# EAGLE design SLogger (EAGLE 6.3)
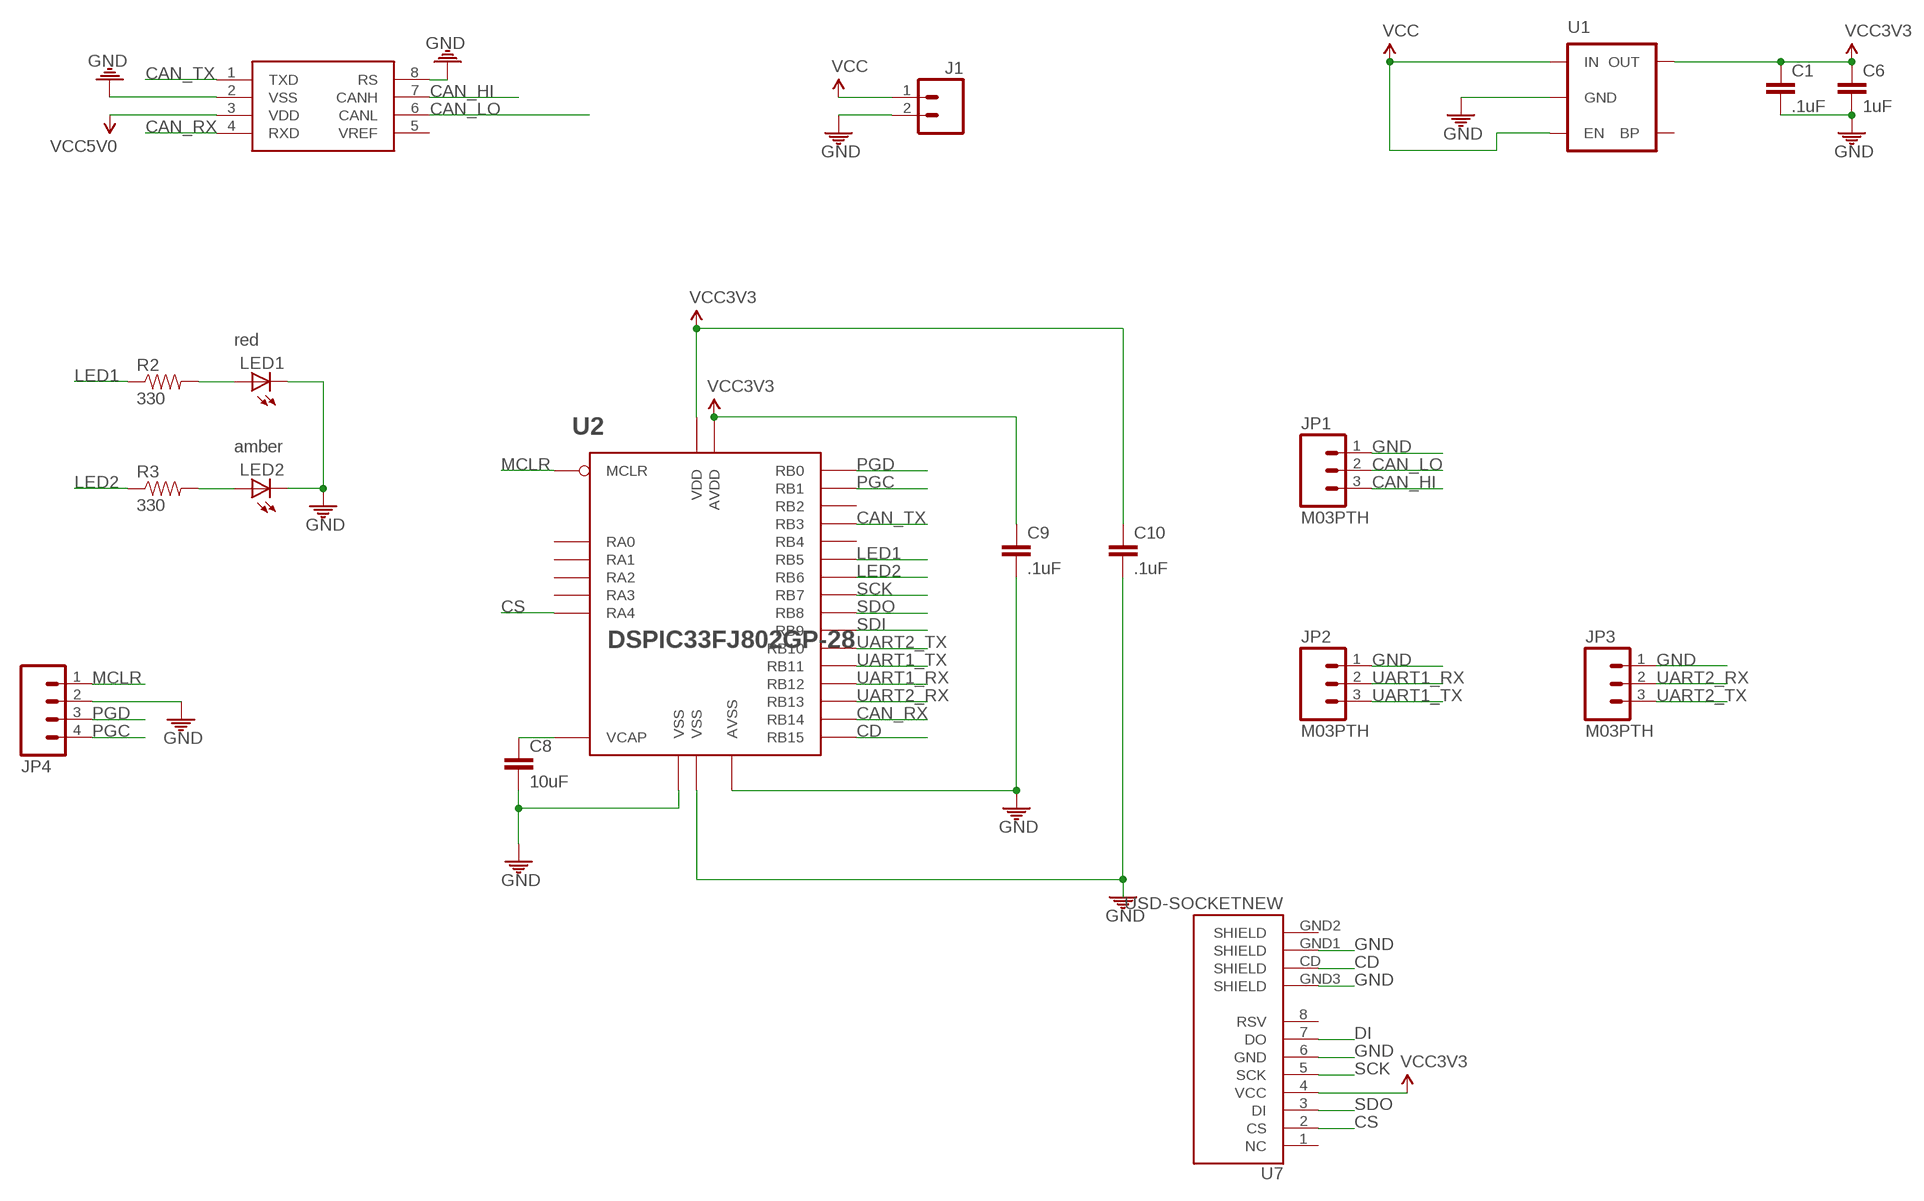
[diagram p0: schematic, sheet 1]

## Parts
C1  .1uF  CAP0805  [0805]
C6  1uF  CAP0805  [0805]
C8  10uF  CAP0805  [0805]
C9  .1uF  CAP0805  [0805]
C10  .1uF  CAP0805  [0805]
J1  M02PTH  [1X02]
JP1  M03PTH  [1X03]
JP2  M03PTH  [1X03]
JP3  M03PTH  [1X03]
JP4  M04PTH  [1X04]
LED1  LED0805  [LED-0805]
LED2  LED0805  [LED-0805]
R2  330  RESISTOR0805-RES  [0805]
R3  330  RESISTOR0805-RES  [0805]
U1  MIC52053.3V  [SOT23-5]
U2  DSPIC33FJ802GP-28  [SOIC28-W]
U4  MCP2551  [SO08]
U7  USD-SOCKETNEW  [MICRO-SD-SOCKET-PP]

## Nets
CAN_HI [small]: JP1.3 U4.7(CANH)
CAN_LO [small]: JP1.2 U4.6(CANL)
CAN_RX: U2.P$25(RB14) U4.4(RXD)
CAN_TX [small]: U2.P$7(RB3) U4.1(TXD)
CD: U2.P$26(RB15) U7.CD(SHIELD)
CS [small]: U2.P$12(RA4) U7.2(CS)
DI [small]: U7.7(DO)
GND [power]: C1.2 C6.2 C8.2 C9.2 C10.2 J1.2 JP1.1 JP2.1 JP3.1 JP4.2 LED1.2(C) LED2.2(C) U1.2(GND) U2.P$8(VSS) U2.P$19(VSS) U2.P$27(AVSS) U4.2(VSS) U4.8(RS) U7.6(GND) U7.GND1(SHIELD) U7.GND3(SHIELD)
LED1: R2.1 U2.P$14(RB5)
LED2: R3.1 U2.P$15(RB6)
MCLR [small]: JP4.1 U2.P$1(MCLR)
N$1 [small]: LED1.1(A) R2.2
N$3 [small]: LED2.1(A) R3.2
N$7: C8.1 U2.P$20(VCAP)
PGC [small]: JP4.4 U2.P$5(RB1)
PGD [small]: JP4.3 U2.P$4(RB0)
SCK [small]: U2.P$16(RB7) U7.5(SCK)
SDI [small]: U2.P$18(RB9)
SDO: U2.P$17(RB8) U7.3(DI)
UART1_RX [small]: JP2.2 U2.P$23(RB12)
UART1_TX [small]: JP2.3 U2.P$22(RB11)
UART2_RX [small]: JP3.2 U2.P$24(RB13)
UART2_TX [small]: JP3.3 U2.P$21(RB10)
VCC [power_in]: J1.1 U1.1(IN) U1.3(EN)
VCC3V3 [power]: C1.1 C6.1 C9.1 C10.1 U1.5(OUT) U2.P$13(VDD) U2.P$28(AVDD) U7.4(VCC)
VCC5V0 [power]: U4.3(VDD)
Unconnected: U1.4(BP) U2.P$2(RA0) U2.P$3(RA1) U2.P$6(RB2) U2.P$9(RA2) U2.P$10(RA3) U2.P$11(RB4) U4.5(VREF) U7.1(NC) U7.8(RSV) U7.GND2(SHIELD)

## Library data of the parts
C1 C6 C8-C10 = ASL:CAP: Capacitor Standard 0603 ceramic capacitor, and 0.1" leaded capacitor.
J1 = ASL:M02: Header 2 Standard 2-pin 0.1" header. Use with straight break away headers (SKU : PRT-00116), right angle break away headers (PRT-00553), swiss pins (PRT-00743), machine pins (PRT-00117), and female headers (PRT-00115). Molex polarized connector foot print use with SKU : PRT-08233 with associated crimp pins and housings.
JP1-JP3 = ASL:M03: Header 3 Standard 3-pin 0.1" header. Use with straight break away headers (SKU : PRT-00116), right angle break away headers (PRT-00553), swiss pins (PRT-00743), machine pins (PRT-00117), and female headers (PRT-00115). Molex polarized connector foot print use with SKU : PRT-08232 with associated crimp pins and housings.
JP4 = SparkFun-Connectors:M04: Header 4 Standard 4-pin 0.1" header. Use with straight break away headers (SKU : PRT-00116), right angle break away headers (PRT-00553), swiss pins (PRT-00743), machine pins (PRT-00117), and female headers (PRT-00115). Molex polarized connector foot print use with SKU : PRT-08231 with associated crimp pins and housings. 1MM SMD Version SKU: PRT-10208
LED1 = ASL:LED: LEDs Standard schematic elements and footprints for 5mm, 3mm, 1206, and 0603 sized LEDs. 5mm - Spark Fun Electronics SKU : COM-00529 (and others); COLOR: red
LED2 = ASL:LED: LEDs Standard schematic elements and footprints for 5mm, 3mm, 1206, and 0603 sized LEDs. 5mm - Spark Fun Electronics SKU : COM-00529 (and others); COLOR: amber
R2 R3 = CMPE118lib:RESISTOR: Resistor Basic schematic elements and footprints for 0603, 1206, and PTH resistors.
U1 = SparkFun-PowerIC:MIC5205: MIC5205 150mA vreg 3.3V - VREG-00822 5V - VREG-00823; PROD_ID: VREG-00822
U2 = CMPE118lib:DSPIC33FJ*802GP-28: dspic33fj*802gp 28pin
U4 = SparkFun:MCP2551
U7 = ASL:USD-SOCKET: microSD Socket Push-push type uSD socket. Schematic element and footprint production proven. Spark Fun Electronics SKU : PRT-00127. tDoc lines correctly indicate media card edge positions when inserting (unlocked, locked, depressed).

## Net classes
0 default: width 0.254 mm
1 power: width 0.406 mm, clearance 0.254 mm to class 0, clearance 0.508 mm
2 small: width 0.203 mm, clearance 0.254 mm to class 1
3 power_in: width 0.508 mm, clearance 0.762 mm to class 1, clearance 0.762 mm

## Board
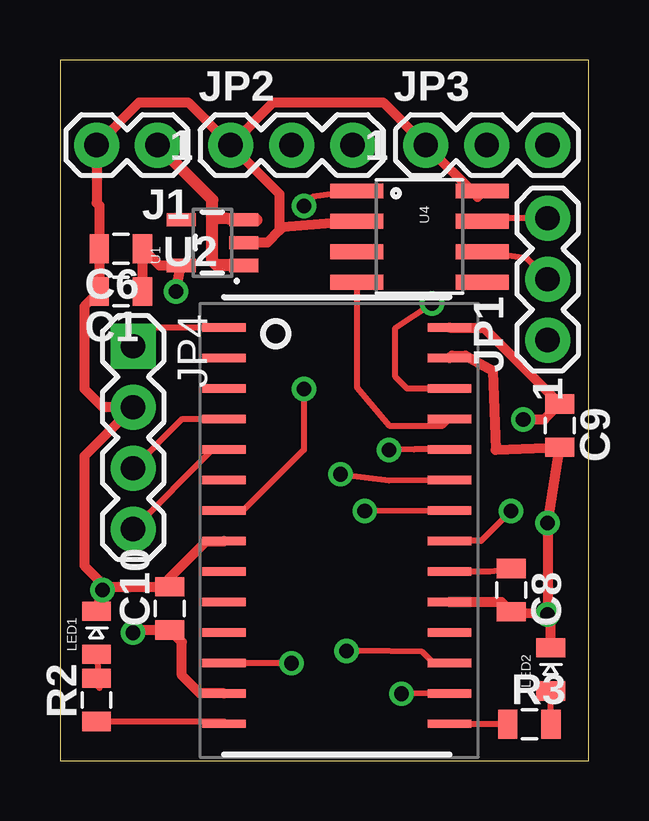
[diagram p1: board, top side]
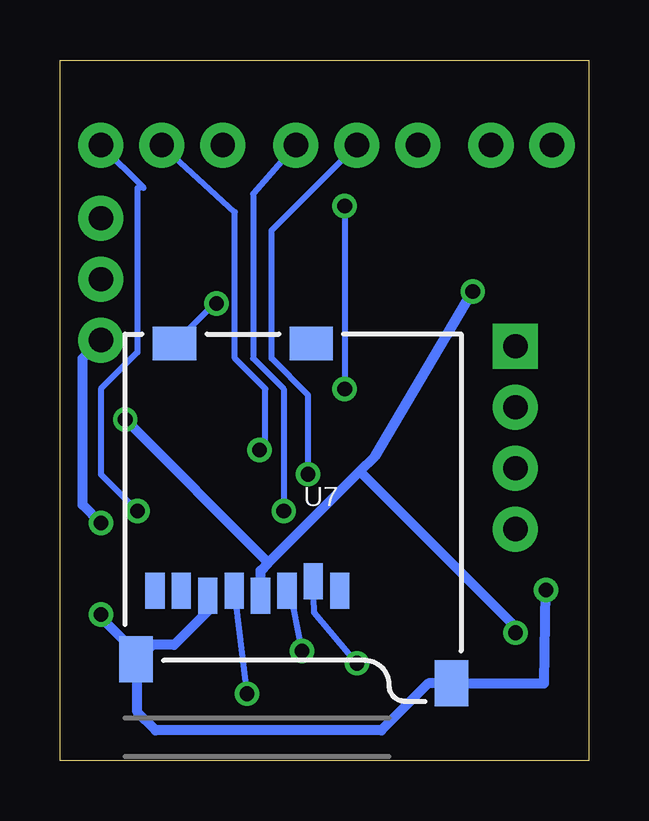
[diagram p2: board, bottom side, seen from below]

Size 22.02 x 29.2 mm. Coordinates in mm from the lower left corner, seen from the top.
Outline: 0,0 22.02,0 22.02,29.2 0,29.2 0,0
Copper layers (1*16): Top 0.035mm / dielectric 1.5mm / Bottom 0.035mm
Design rules "default": minimum track width 10mil, minimum drill 24mil, track to track 8mil, track to pad 8mil, pad to pad 8mil, via to via 8mil, smd to smd 8mil, copper to edge 40mil, drill to drill 8mil, minimum pad ring 10mil, minimum via ring 8mil, stop-mask expansion 4mil, vias tented up to drill 0mil, thermal gap 10mil

### Footprints (pad centres in the part's own frame; a part is rotated, then mirrored left to right if it is on the bottom)
0805 = smd 0.8 x 1.2: 1 -0.9,0; 2 0.9,0
1X02 = drill 1.016 pad 1.88: 1 0,0; 2 2.54,0
1X03 = drill 1.016 pad 1.88: 1 -2.54,0; 2 0,0; 3 2.54,0
1X04 = drill 1.016 pad 1.88 square: 1 0,0 | drill 1.016 pad 1.88: 2 2.54,0; 3 5.08,0; 4 7.62,0
LED-0805 = smd 0.8 x 1.2: 1 -0.9,0; 2 0.9,0
SOT23-5 = smd 0.55 x 1.2: 1 -0.95,-1.3; 2 0,-1.3; 3 0.95,-1.3; 4 0.95,1.3; 5 -0.95,1.3
SOIC28-W = smd 1.8 x 0.35: P$1 -4.6,8.4; P$2 -4.6,7.13; P$3 -4.6,5.86; P$4 -4.6,4.59; P$5 -4.6,3.32; P$6 -4.6,2.05; P$7 -4.6,0.78; P$8 -4.6,-0.49; P$9 -4.6,-1.76; P$10 -4.6,-3.03; P$11 -4.6,-4.3; P$12 -4.6,-5.57; P$13 -4.6,-6.84; P$14 -4.6,-8.11; P$15 4.8,-8.11; P$16 4.8,-6.84; P$17 4.8,-5.57; P$18 4.8,-4.3; P$19 4.8,-3.03; P$20 4.8,-1.76; P$21 4.8,-0.49; P$22 4.8,0.78; P$23 4.8,2.05; P$24 4.8,3.32; P$25 4.8,4.59; P$26 4.8,5.86; P$27 4.8,7.13; P$28 4.8,8.4
SO08 = smd 0.61 x 2.21: 1 -1.905,-2.616; 2 -0.635,-2.616; 3 0.635,-2.616; 4 1.905,-2.616; 5 1.905,2.616; 6 0.635,2.616; 7 -0.635,2.616; 8 -1.905,2.616
MICRO-SD-SOCKET-PP = smd 0.8 x 1.5: 1 -8.94,10.7; 2 -7.84,10.3; 3 -6.74,10.7; 4 -5.64,10.9; 5 -4.54,10.7; 6 -3.44,10.9; 7 -2.34,10.7; 8 -1.24,10.7 | smd 1.8 x 1.4: CD -2.05,0.4; GND2 -7.75,0.4 | smd 1.4 x 1.9: GND1 -13.6,14.55; GND3 -0.45,13.55

### Placement (x,y rotation side)
C1  2.54,19.56 180 top
C6  2.54,21.34 180 top
C8  18.8,7.11 270 top
C9  20.83,13.97 270 top
C10  4.57,6.35 90 top
J1  4.06,25.65 180 top
JP1  20.32,20.07 90 top
JP2  9.65,25.65 0 top
JP3  17.78,25.65 0 top
JP4  3.05,17.27 270 top
LED1  1.52,5.33 90 top
LED2  20.45,3.81 90 top
R2  1.52,2.54 90 top
R3  19.56,1.52 0 top
U1  6.35,21.59 90 top
U2  11.43,9.65 0 top
U4  14.99,21.84 270 top
U7  19.3,17.78 180 bottom

### Tracks (layer width: path | path; a pad name or v marks a point on that pad's centre or on a via)
CAN_HI
  Top 0.254: JP1.3 17.98,22.61 U4.7
CAN_LO
  Top 0.254: U4.6 19.43,20.95 JP1.2
CAN_RX
  Top 0.254: U4.4 12.37,15.57 13.72,13.97 15.96,13.97 U2.P$25
CAN_TX  (via drill 0.61, 0.61 pad 1.02)
  Top 0.254: U4.1 10.54,23.5 v10.16,23.11 | v10.16,15.49 10.16,12.95 7.62,10.41 6.85,10.41 U2.P$7
  Bottom 0.254: v10.16,23.11 v10.16,15.49
CD  (via drill 0.61)
  Top 0.254: U2.P$26 14.46,15.51 13.97,16 13.97,18.03 v15.49,19.05
  Bottom 0.254: v15.49,19.05 15.49,19.14 U7.CD
CS  (via drill 0.61)
  Top 0.254: U2.P$12 9.67,4.08 v9.65,4.06
  Bottom 0.254: v9.65,4.06 11.43,6.18 U7.2
GND  (via drill 0.61)
  Top 0.406: JP2.1 5.33,27.43 3.3,27.43 J1.2 1.52,23.25 1.64,23.14 C6.2 C1.2 1.02,18.93 1.02,15.49 1.78,14.73 JP4.2 1.02,12.7 1.02,8.13 1.89,7.25 | JP2.1 8.89,27.43 13.46,27.43 JP3.1 17.4,23.5 U4.8 | JP2.1 9.14,23.62 9.14,22.1 | 9.14,22.1 8.64,21.59 U1.2 | 1.89,7.25 1.78,7.25 | 1.89,7.25 C10.2 4.57,7.62 6.1,9.14 6.81,9.14 U2.P$8 | v1.78,7.11 LED1.2 1.78,7.25 | v1.78,7.11 1.89,7.25 | 18.66,6.33 C8.2 | U4.2 9.27,22.23 9.14,22.1 | U2.P$27 16.33,16.88 16.9,16.88 18.03,16.26 18.15,12.95 C9.2 v20.32,9.91 v20.32,6.1 | v1.78,7.11 1.78,7.25 | 18.66,6.07 C8.2 | C8.2 v20.32,6.1 | U2.P$19 18.39,6.62 C8.2 | LED2.2 20.45,5.97 v20.32,6.1
  Bottom 0.406: U7.GND3 18.85,4.63 | U7.6 15.86,6.23 17.27,4.83 18.15,4.83 18.66,4.32 | 18.66,4.32 18.77,4.32 U7.GND3 | U7.GND3 18.8,4.17 18.8,2.03 18.03,1.27 8.64,1.27 6.68,3.23 U7.GND1 1.85,3.23 v1.78,7.11 | v20.32,9.91 21.08,10.67 21.08,16.76 JP1.1 | v20.32,6.1 20.32,5.98 18.66,4.32
LED1
  Top 0.254: R2.1 6.83,1.64 U2.P$14
LED2
  Top 0.254: U2.P$15 18.64,1.54 R3.1
MCLR
  Top 0.254: U2.P$1 3.07,18.05 JP4.1
N$1
  Top 0.254: LED1.1 1.64,3.03 R2.2
N$3
  Top 0.254: R3.2 LED2.1
N$7
  Top 0.254: U2.P$20 17.91,7.89 C8.1
PGC
  Top 0.254: JP4.4 6.35,12.95 7.37,12.95 7.35,12.97 U2.P$5
PGD
  Top 0.254: JP4.3 5.1,14.24 U2.P$4
SCK  (via drill 0.61)
  Top 0.254: U2.P$16 15.48,2.81 v14.22,2.79
  Bottom 0.254: v14.22,2.79 14.73,7.05 U7.5
SDO  (via drill 0.61)
  Top 0.254: U2.P$17 15.56,4.08 15.1,4.54 12.44,4.58 v11.94,4.57
  Bottom 0.254: v11.94,4.57 12.45,7.2 U7.3
UART1_RX  (via drill 0.61 pad 1.02)
  Top 0.254: v11.68,11.94 13.72,11.68 15.48,11.7 U2.P$23
  Bottom 0.254: JP2.2 13.21,22.1 13.21,16.76 11.68,15.24 v11.68,11.94
UART1_TX  (via drill 0.61)
  Top 0.254: v12.7,10.41 15.73,10.43 U2.P$22
  Bottom 0.254: JP2.3 13.97,23.62 13.97,16.76 12.7,15.49 v12.7,10.41
UART2_RX  (via drill 0.61)
  Top 0.254: U2.P$24 14.75,12.97 v13.72,12.95
  Bottom 0.254: JP3.2 14.73,22.86 14.73,16.76 13.46,15.49 13.46,13.21 v13.72,12.95
UART2_TX  (via drill 0.61)
  Top 0.254: v18.8,10.41 17.54,9.16 U2.P$21
  Bottom 0.254: JP3.3 18.54,23.88 18.8,23.88 18.8,17.02 20.32,15.49 20.32,11.94 v18.8,10.41
VCC
  Top 0.508: U1.1 6.54,20.64 6.35,20.83 6.35,22.61 | 6.35,22.61 6.35,23.37 J1.1 | U1.3 8.19,22.54 6.35,22.61
VCC3V3  (via drill 0.61, 0.61 pad 1.02)
  Top 0.406: 5.01,20.64 v4.83,19.56 | C1.1 C6.1 4.14,20.64 5.01,20.64 | 5.01,20.64 U1.5 | U2.P$28 17.65,18.05 C9.1 20.18,14.22 v19.3,14.22 | U2.P$13 5.82,2.81 5.08,3.56 5.08,4.94 C10.1 3.16,5.45 v3.05,5.33
  Bottom 0.406: U7.4 13.66,7.93 13.34,8.26 | 13.34,8.26 9.53,12.06 | 9.53,12.06 8.89,12.7 v4.83,19.56 | 13.34,8.26 v19.3,14.22 | v3.05,5.33 3.05,5.59 9.53,12.06